# Altium schematic sheet 8 GPS.SchDoc
size B; DocumentNumber: 8; SheetNumber: 8; SheetTotal: 17
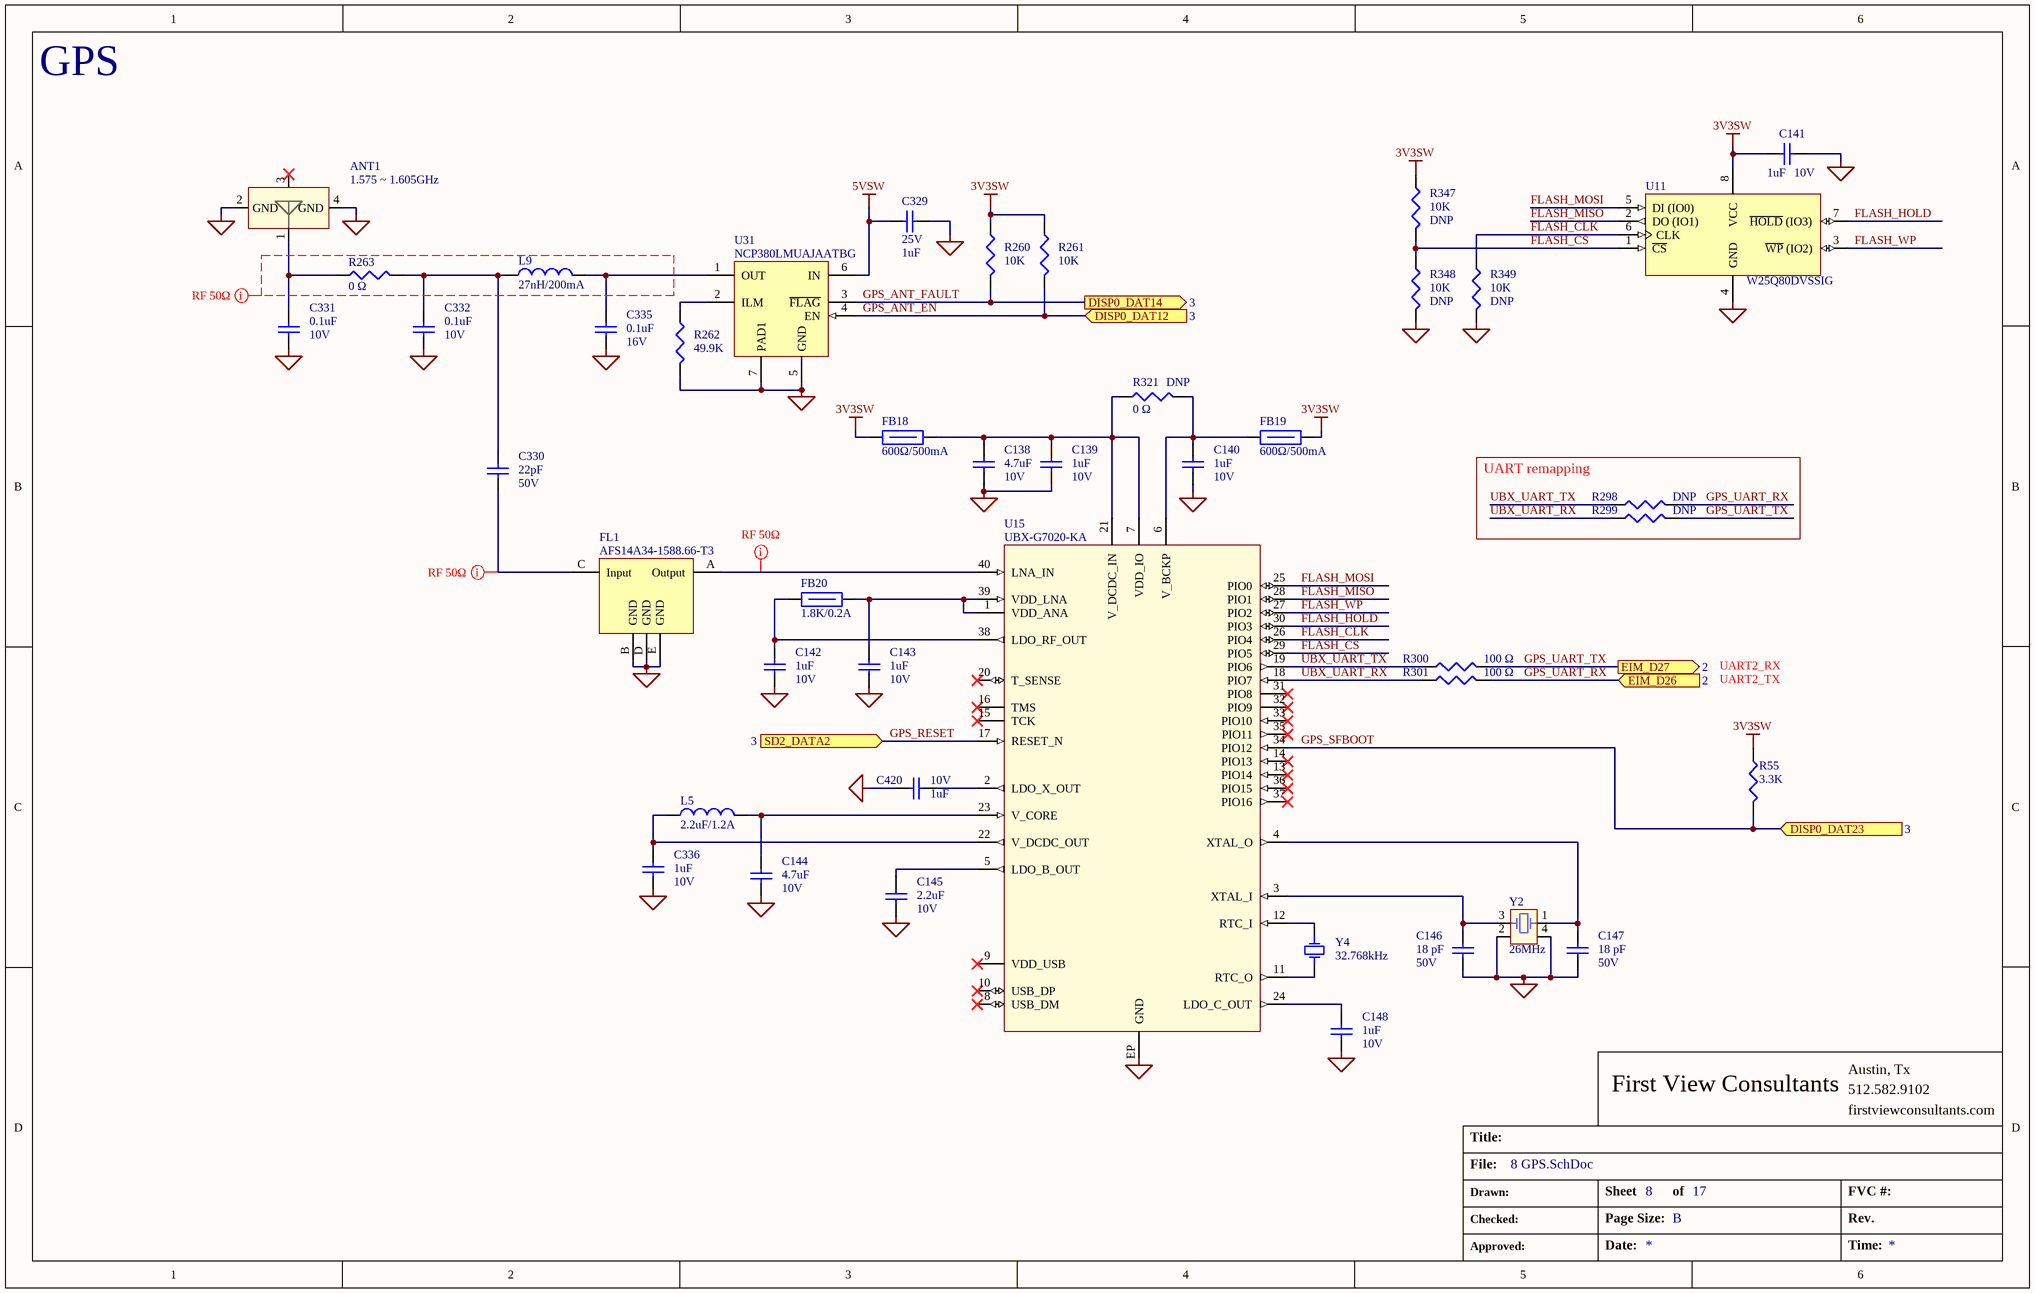
[diagram p0: 8 GPS.SchDoc]

## Parts
ANT1  value 1.575 ~ 1.605GHz  [ANT_1575AT54A0010E]  (hidden comment: 1575AT54A0010E)
C138  value 4.7uF  Voltage: 10V  [CAP_0402]  (hidden comment: Cap 4.7uF 10V 0603)
C139  value 1uF  Voltage: 10V  [CAP_0402]  (hidden comment: Cap 1uF 10V 0402)
C140  value 1uF  Voltage: 10V  [CAP_0402]  (hidden comment: Cap 1uF 10V 0402)
C141  value 1uF  Voltage: 10V  [CAP_0402]  (hidden comment: Cap 1uF 10V 0402)
C142  value 1uF  Voltage: 10V  [CAP_0402]  (hidden comment: Cap 1uF 10V 0402)
C143  value 1uF  Voltage: 10V  [CAP_0402]  (hidden comment: Cap 1uF 10V 0402)
C144  value 4.7uF  Voltage: 10V  [CAP_0402]  (hidden comment: Cap 4.7uF 10V 0603)
C145  value 2.2uF  Voltage: 10V  [CAP_0402]  (hidden comment: Cap 2.2uF 10V 0402)
C146  value 18 pF  Voltage: 50V  [CAP_0402]  (hidden comment: Cap 18pF 50V 0402)
C147  value 18 pF  Voltage: 50V  [CAP_0402]  (hidden comment: Cap 18pF 50V 0402)
C148  value 1uF  Voltage: 10V  [CAP_0402]  (hidden comment: Cap 1uF 10V 0402)
C329  value 1uF  Voltage: 25V  [CAP_0402]  (hidden comment: Cap 1uF 25V 0402)
C330  value 22pF  Voltage: 50V  [CAP_0402]  (hidden comment: Cap 22pF 50V 0402)
C331  value 0.1uF  Voltage: 10V  [CAP_0402]  (hidden comment: Cap 0.1uF 10V 0402)
C332  value 0.1uF  Voltage: 10V  [CAP_0402]  (hidden comment: Cap 0.1uF 10V 0402)
C335  value 0.1uF  Voltage: 16V  [CAP_0402]  (hidden comment: Cap 0.1uF 16V 0402)
C336  value 1uF  Voltage: 10V  [CAP_0402]  (hidden comment: Cap 1uF 10V 0402)
C420  value 1uF  Voltage: 10V  [CAP_0402]  (hidden comment: Cap 1uF 10V 0402)
FB18  value 600Ω/500mA  [IND_0603]  (hidden comment: BLM18EG601SN1D)
FB19  value 600Ω/500mA  [IND_0603]  (hidden comment: BLM18EG601SN1D)
FB20  value 1.8K/0.2A  [IND_0402]  (hidden comment: BLM15HD182SN1)
FL1  AFS14A34-1588.66-T3  [SMD(1.4x1.1)_AFS14A34-1588.66-T3]
L5  value 2.2uF/1.2A  [IND_0806]  (hidden comment: LQM2MPN2R2NG0L)
L9  value 27nH/200mA  [IND_0402]  (hidden comment: L-07C27NJV6T)
R55  value 3.3K  [RES_0402]  (hidden comment: Res 3.3K 0.063W)
R260  value 10K  [RES_0402]  (hidden comment: Res 10K 0.063W)
R261  value 10K  [RES_0402]  (hidden comment: Res 10K 0.063W)
R262  value 49.9K  [RES_0402]  (hidden comment: Res 49.9K 0.063W)
R263  value 0 Ω  [RES_0402]  (hidden comment: Res 0 ohm 0.1W)
R298  Res 0 ohm 0.1W DNP  [RES_0402]  (value not drawn)
R299  Res 0 ohm 0.1W DNP  [RES_0402]  (value not drawn)
R300  value 100 Ω  [RES_0402]  (hidden comment: Res 100R 0.063W)
R301  value 100 Ω  [RES_0402]  (hidden comment: Res 100R 0.063W)
R321  value 0 Ω  [RES_0402]  (hidden comment: Res 0 ohm 0.1W)
R347  value 10K  [RES_0402]  (hidden comment: Res 10K 0.063W)
R348  value 10K  [RES_0402]  (hidden comment: Res 10K 0.063W)
R349  value 10K  [RES_0402]  (hidden comment: Res 10K 0.063W)
U11  W25Q80DVSSIG  [SOIC-8_W25Q80DVSSIG]
U15  UBX-G7020-KA  [QFN-40_UBX-G7020-KA]
U31  NCP380LMUAJAATBG  [UDFN-6_NCP380LMUAJAATBG]
Y2  value 26MHz  [DFN(3.2x2.5)_403I35D26M00000]  (hidden comment: 403I35D26M00000)
Y4  value 32.768kHz  [SMD(3.2x1.5)_SC32S-12.5PF20PPM]  (hidden comment: SC32S-12.5PF20PPM)

## Blocks framed on the sheet
UART remapping: R298 R299

## Ports
DISP0_DAT12 (in, see 3), DISP0_DAT14 (out, see 3), DISP0_DAT23 (in, see 3), EIM_D26 (in, see 2), EIM_D27 (out, see 2), SD2_DATA2 (in, see 3)

## Nets
3V3SW: C141.1 FB18.1 FB19.2 R55.1 R260.1 R261.1 R347.1 U11.8(VCC)
5VSW: C329.1 U31.6(IN)
GND: ANT1.2(GND) ANT1.4(GND) C138.2 C139.2 C140.2 C141.2 C142.2 C143.2 C144.2 C145.2 C146.1 C147.1 C148.2 C329.2 C331.1 C332.1 C335.2 C336.2 C420.2 FL1.B(GND) FL1.D(GND) FL1.E(GND) R262.2 R348.2 R349.2 U11.4(GND) U15.EP(GND) U31.5(GND) U31.7(PAD1) Y2.2 Y2.4
FLASH_CLK: R349.1 U11.6(CLK) U15.26(PIO4)
FLASH_CS: R347.2 R348.1 U11.1(~{CS}) U15.29(PIO5)
FLASH_HOLD: U11.7(~{HOLD}_(IO3)) U15.30(PIO3)
FLASH_MISO: U11.2(DO_(IO1)) U15.28(PIO1)
FLASH_MOSI: U11.5(DI_(IO0)) U15.25(PIO0)
FLASH_WP: U11.3(~{WP}_(IO2)) U15.27(PIO2)
GPS_ANT_EN: R261.2 U31.4(EN) ; port DISP0_DAT12
GPS_ANT_FAULT: R260.2 U31.3(~{FLAG}) ; port DISP0_DAT14
GPS_RESET: U15.17(RESET_N) ; port SD2_DATA2
GPS_SFBOOT: R55.2 U15.34(PIO12) ; port DISP0_DAT23
GPS_UART_RX: R298.2 R301.2 ; port EIM_D26
GPS_UART_TX: R299.2 R300.2 ; port EIM_D27
UBX_UART_RX: R299.1 R301.1 U15.18(PIO7)
UBX_UART_TX: R298.1 R300.1 U15.19(PIO6)
NetANT1_1: ANT1.1 C331.2 R263.1
NetC138_1: C138.1 C139.1 FB18.2 R321.1 U15.7(VDD_IO) U15.21(V_DCDC_IN)
NetC140_1: C140.1 FB19.1 R321.2 U15.6(V_BCKP)
NetC142_1: C142.1 FB20.1 U15.38(LDO_RF_OUT)
NetC143_1: C143.1 FB20.2 U15.1(VDD_ANA) U15.39(VDD_LNA)
NetC144_1: C144.1 L5.2 U15.23(V_CORE)
NetC145_1: C145.1 U15.5(LDO_B_OUT)
NetC146_2: C146.2 U15.3(XTAL_I) Y2.3(OSC2)
NetC147_2: C147.2 U15.4(XTAL_O) Y2.1(OSC1)
NetC148_1: C148.1 U15.24(LDO_C_OUT)
NetC330_1: C330.1 FL1.C(Input)
NetC330_2: C330.2 C332.2 L9.1 R263.2
NetC335_1: C335.1 L9.2 U31.1(OUT)
NetC336_1: C336.1 L5.1 U15.22(V_DCDC_OUT)
NetC420_1: C420.1 U15.2(LDO_X_OUT)
NetFL1_A: FL1.A(Output) U15.40(LNA_IN)
NetR262_1: R262.1 U31.2(ILM)
NetU15_11: U15.11(RTC_O) Y4.2(OSC2)
NetU15_12: U15.12(RTC_I) Y4.1(OSC1)

Not connected (* = marked no-connect by the designer): ANT1 3*; U15 8(USB_DM)* 9(VDD_USB)* 10(USB_DP)* 13(PIO14)* 14(PIO13)* 15(TCK)* 16(TMS)* 20(T_SENSE)* 31(PIO8)* 32(PIO9)* 33(PIO10)* 35(PIO11)* 36(PIO15)* 37(PIO16)*

## Layout directives
net class RF 50ohm: (no net found under the mark), NetC330_1, NetFL1_A

## Notes on the sheet
- GPS
- UART2_RX
- UART2_TX
- First View Consultants
- Austin, Tx
- 512.582.9102
- Title:
- File:
- firstviewconsultants.com
- Drawn:
- Checked:
- Sheet
- Page Size:
- of
- B
- FVC #:
- Rev.
- Approved:
- Date:
- Time:

## Library data of the parts
ANT1 = 1575AT54A0010E: Antenna, GPS GLONASS, SMD; Manufacturer: Johanson Technology, Inc.; Operating Temperature: -40+85°C; Manufacturer #: 1575AT54A0010E
C138 C144 = Cap 4.7uF 10V 0603: Cap, Cer, 4.7uF, 10V, 10%, X5R, 0603; Manufacturer #: LMK107BJ475KA-T; Manufacturer: Taiyo Yuden; Have Footprint: yes; Tolerance: ±10%; Package: 0402
C139-C143 C148 C336 C420 = Cap 1uF 10V 0402: Cap, Cer, 1uF, 10V, ±10%, X5R, 0402; Manufacturer #: CC0402KRX5R6BB105; Manufacturer: Yageo; Have Footprint: yes; Package: 0402
C145 = Cap 2.2uF 10V 0402: Cap, Cer, 2.2uF, 10V, 10%, X5R, 0402; Manufacturer #: C0402C225M8PACTU; Manufacturer: Kemet; Have Footprint: yes; Package: 0402
C146 C147 = Cap 18pF 50V 0402: Cap, Cer, 18pF, 50V, 5%, C0G, 0402; Manufacturer #: C1005C0G1H180J050BA; Manufacturer: TDK Corporation; Have Footprint: yes; Package: 0402
C329 = Cap 1uF 25V 0402: Cap, Cer, 1uF, 25V, 10%, X5R, 0402; Manufacturer #: TMK105BJ105MV-F; Manufacturer: Taiyo Yuden; Have Footprint: yes; Package: 0402
C330 = Cap 22pF 50V 0402: Cap, Cer, 22pF, 50V, 5%, C0G/NPO, 0402; Manufacturer #: CC0402JRNPO9BN220; Manufacturer: Yageo; Have Footprint: yes; Package: 0402
C331 C332 = Cap 0.1uF 10V 0402: Cap, Cer, 0.1uF, 10V, 10%, X5R, 0402; Manufacturer: Murata Electronics North America; Manufacturer #: GRM155R61A104KA01J; Have Footprint: yes; Tolerance: ±10%; PACKAGE: 0402
C335 = Cap 0.1uF 16V 0402: Cap, Cer, 0.1uF, 16V, 10%, X7R, 0402; Manufacturer #: GRM155R71C104KA88D; Manufacturer: Murata Electronics North America; Have Footprint: yes; Package: 0402; Tolerance: ±10%
FB18 FB19 = BLM18EG601SN1D: Ind, Ferrite Bead, 600R, 350mOhm, 0.5A, 0603; Manufacturer: Murata Electronics North America; Have Footprint: yes; Manufacturer #: BLM18EG601SN1D; Package: 0603
FB20 = BLM15HD182SN1: Ind, Ferrite Bead, 1.8K, 2.2Ohm, 0.2A, 0402; Manufacturer: Murata Electronics North America; RoHS: yes; Package: 0402; Manufacturer #: BLM15HD182SN1
FL1 = AFS14A34-1588.66-T3: Filter, SAW, 1.58866GHz, SMD; Manufacturer: Abracon; Package: SMD(1.4x1.1); Operating Temperature: -30°C ~ 85°C; RoHS: yes; Manufacturer #: AFS14A34-1588.66-T3
L5 = LQM2MPN2R2NG0L: Ind, Power, 2.2uH, 1.2A, 110 mOhm, 0806; Manufacturer: Murata Electronics North America; Tolerance: 25%; RoHS: yes; Operating Temperature: -55°C ~ 125°C; Package: 0806; Manufacturer #: LQM2MPN2R2NG0L
L9 = L-07C27NJV6T: Ind, RF, 27nH, 0.2A, 0402; Manufacturer: Johanson Technology Inc; Tolerance: 5%; RoHS: yes; Operating Temperature: -40°C ~ 100°C; Package: 0402; Manufacturer #: L-07C27NJV6T
R55 = Res 3.3K 0.063W: Res, 3.3K, 0.063W, 1%, 0402; Manufacturer #: MCR01MRTF3301; Manufacturer: Rohm Semiconductor; Have Footprint: yes; Package: 0402
R260 R261 R347-R349 = Res 10K 0.063W: Res, 10K, 1/16W, 1%, 0402; Manufacturer #: RC0402FR-0710KL; Manufacturer: Yageo; Have Footprint: yes; Package: 0402
  R347-R349: DNP: DNP
R262 = Res 49.9K 0.063W: Res, 49.9K, 0.063W, 1%, 0402; Manufacturer #: MCR01MRTF4992; Manufacturer: Rohm Semiconductor; Have Footprint: yes; Package: 0402; Operating Temperature: -55°C ~ 155°C
R263 R321 = Res 0 ohm 0.1W: Res, 0 ohm, 1/16W, 0402; Manufacturer #: CRCW04020000Z0ED; Manufacturer: Vishay Dale; Have Footprint: yes; Package: 0402
  R321: DNP: DNP
R298 R299 = Res 0 ohm 0.1W DNP: Res, 0 ohm, 1/16W, 0402; Manufacturer #: CRCW04020000Z0ED; Manufacturer: Vishay Dale; Have Footprint: yes; Value: 0 Ω; Package: 0402; DNP: DNP
R300 R301 = Res 100R 0.063W: Res, 100R, 0.063W, 1%, 0402; Manufacturer #: TRR01MZPF1000; Manufacturer: Murata Electronics North America; Have Footprint: yes; Package: 0402
U11 = W25Q80DVSSIG: IC, Flash, SPI, 2.5/3/3.3V, 4M-bit, SOIC-8; Manufacturer: Winbond; Have Footprint: yes; RoHS: yes; Manufacturer #: W25Q80DVSSIG
U15 = UBX-G7020-KA: IC, GPS, QFN-40; Manufacturer: U-Blox; Have Footprint: yes; RoHS: yes; Manufacturer #: UBX-G7020-KA; Package: QFN-40
U31 = NCP380LMUAJAATBG: IC, Power Switch, Adj., 2.1A, UDFN-6; Manufacturer: ON Semiconductor; θJA: 120; Have Footprint: yes; Package: UDFN-6; Operating Temperature: -40°C ~ 125°C; RoHS: yes; Manufacturer #: NCP380LMUAJAATBG
Y2 = 403I35D26M00000: Clock, Crystal, 26MHz, 50ppm, 18pf, -40+85°C, SMD; Manufacturer: CTS-Frequency Controls; Package: DFN(3.2x2.5mm); Manufacturer #: 403I35D26M00000
Y4 = SC32S-12.5PF20PPM: Clock, Crystal, 32.768kHz, 20ppm, 12.5pf, SMD; Manufacturer: Seiko Instruments; Operating Temperature: -40°C ~ 85°C; Package: SMD (3.2x1.5); Manufacturer #: SC32S-12.5PF20PPM